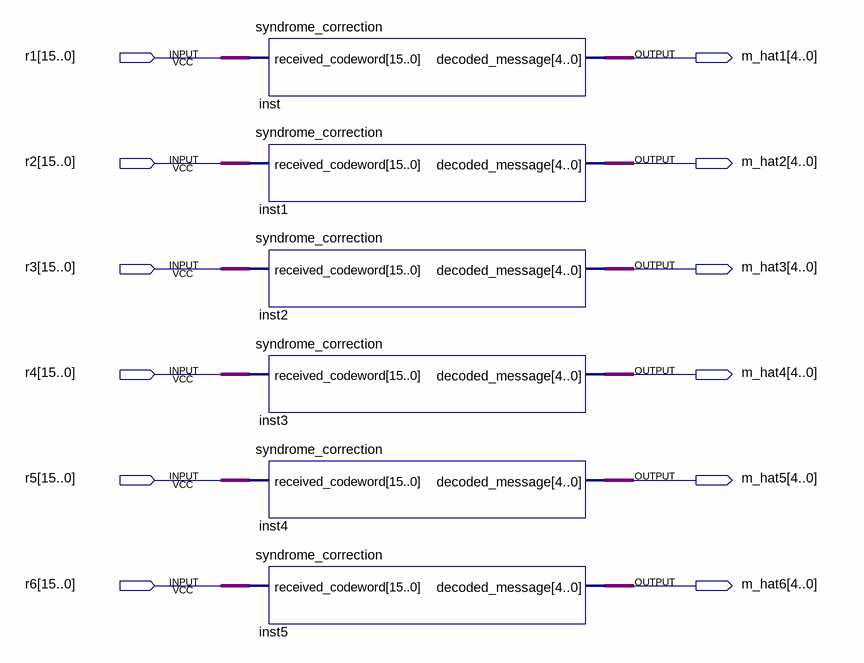
[diagram p0: schematic sheet]
// Quartus schematic parallel_syndrome_correction.bdf as structural Verilog: 6 symbols, 12 pins
module parallel_syndrome_correction (
  input  [15:0] r1,
  input  [15:0] r2,
  input  [15:0] r3,
  input  [15:0] r4,
  input  [15:0] r5,
  input  [15:0] r6,
  output [4:0] m_hat1,
  output [4:0] m_hat2,
  output [4:0] m_hat3,
  output [4:0] m_hat4,
  output [4:0] m_hat5,
  output [4:0] m_hat6
);

  syndrome_correction inst (.received_codeword(r1), .decoded_message(m_hat1));
  syndrome_correction inst1 (.received_codeword(r2), .decoded_message(m_hat2));
  syndrome_correction inst2 (.received_codeword(r3), .decoded_message(m_hat3));
  syndrome_correction inst3 (.received_codeword(r4), .decoded_message(m_hat4));
  syndrome_correction inst4 (.received_codeword(r5), .decoded_message(m_hat5));
  syndrome_correction inst5 (.received_codeword(r6), .decoded_message(m_hat6));
endmodule
